# EAGLE design moonclock (EAGLE 9.6.2)
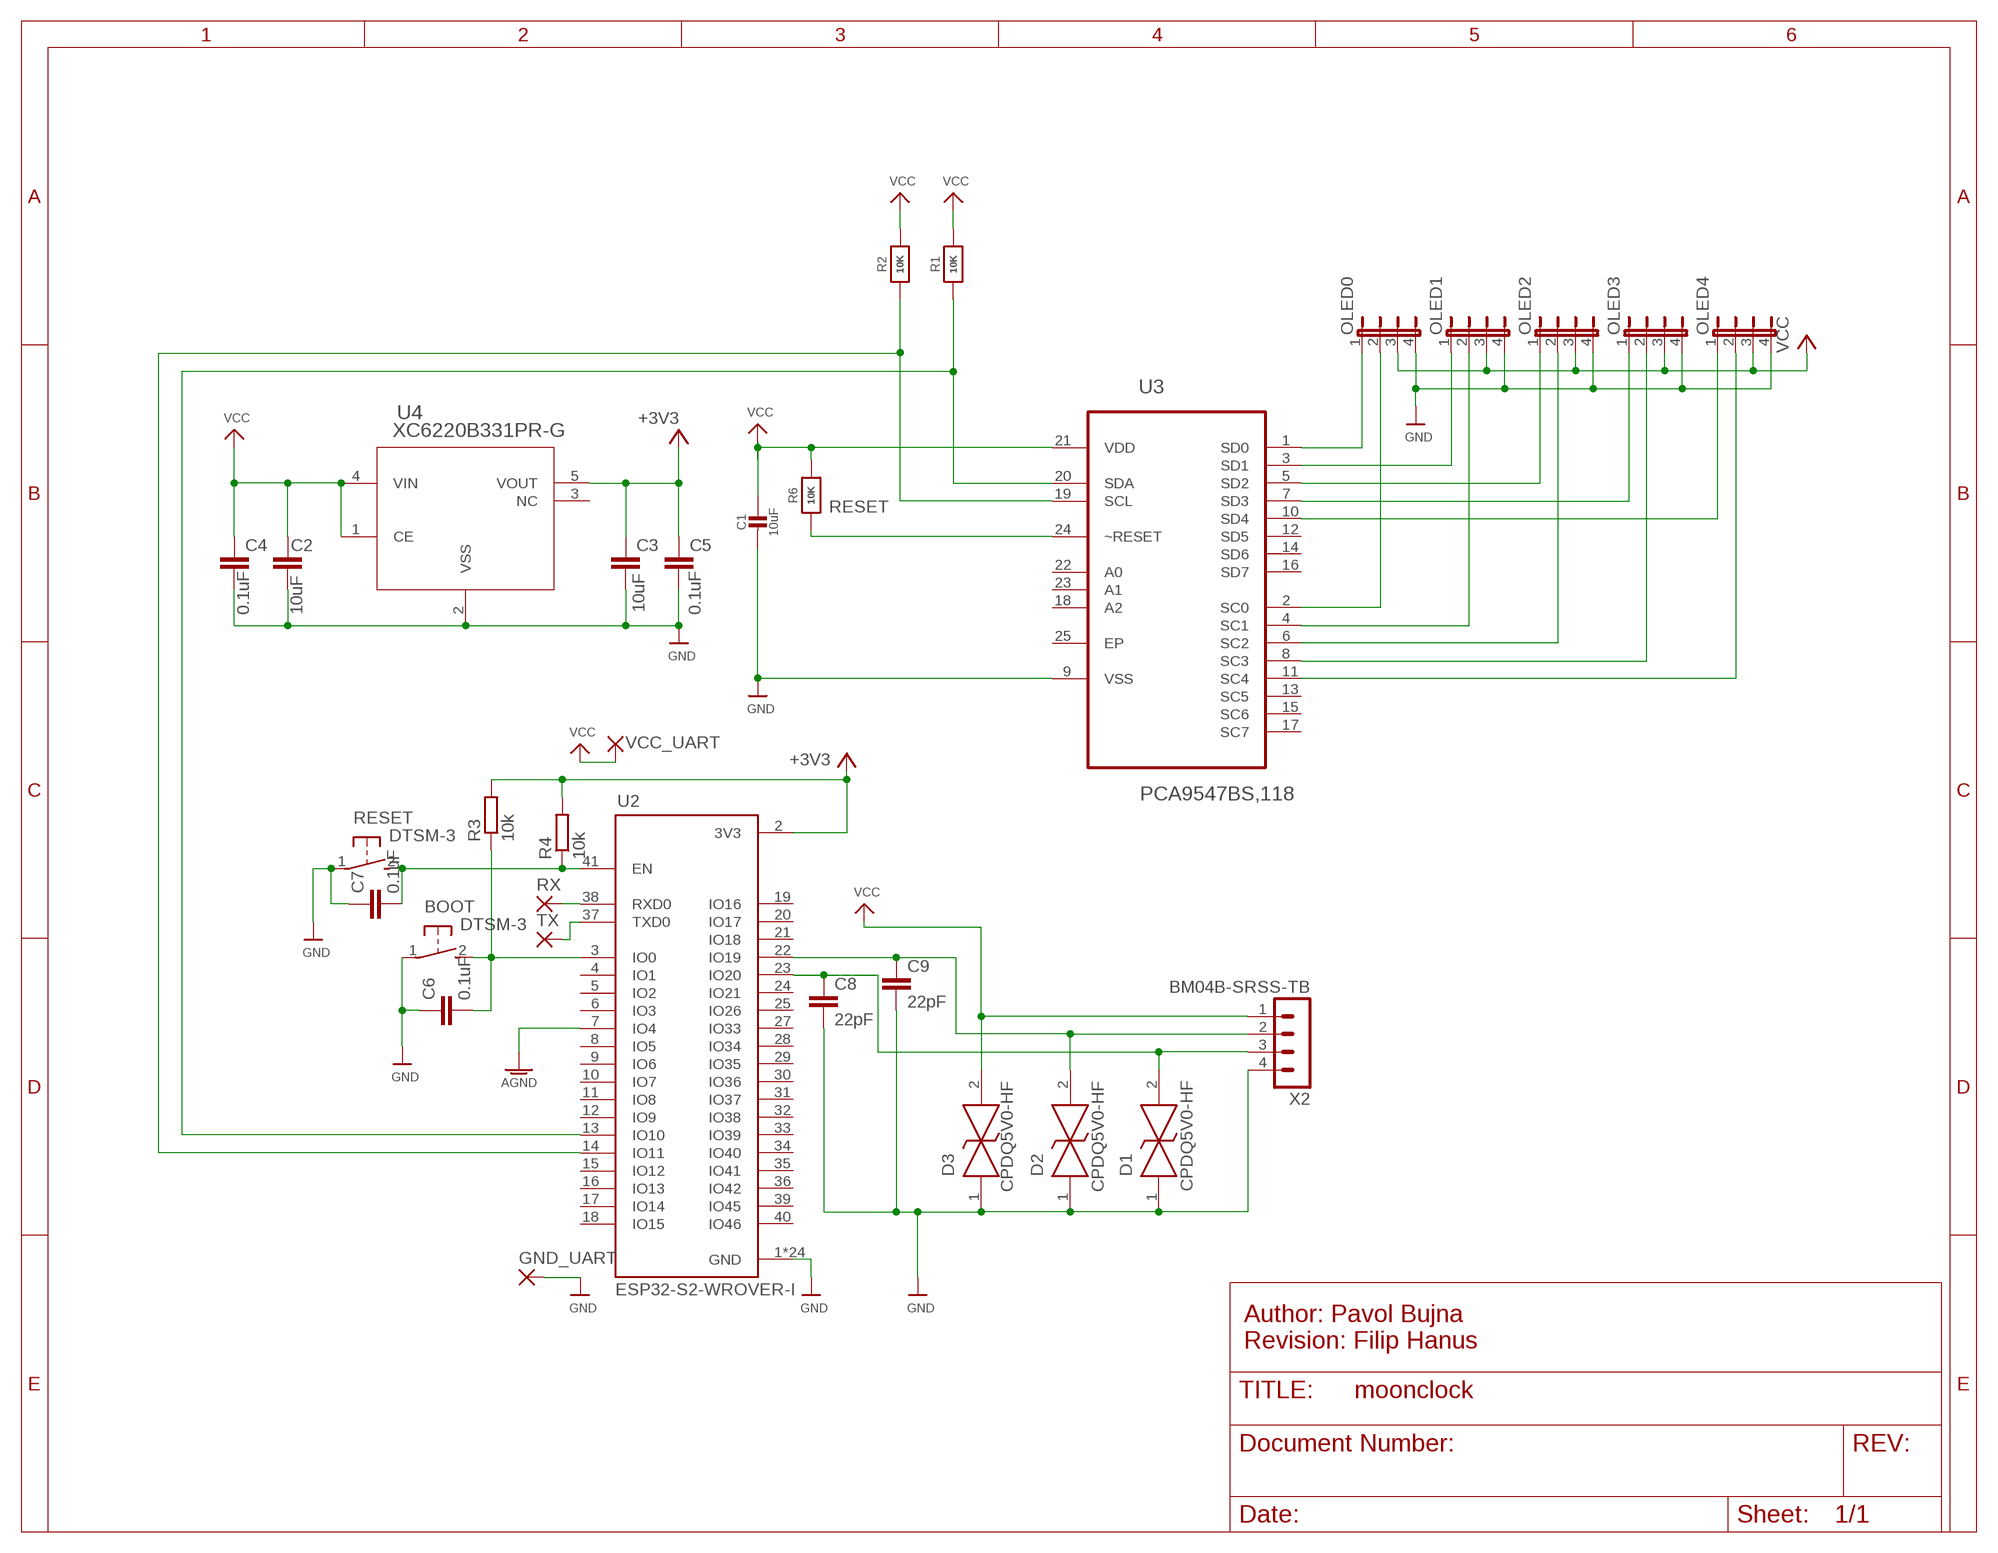
[diagram p0: schematic, sheet 1]

## Parts
BOOT  DTSM-3  [DTSM-3]
C1  10uF  CAP_CERAMIC0805-NOOUTLINE  [0805-NO]
C2  10uF  C-EUC0805  [C0805]
C3  10uF  C-EUC0805  [C0805]
C4  0.1uF  C-EUC0805  [C0805]
C5  0.1uF  C-EUC0805  [C0805]
C6  0.1uF  C-EUC0805  [C0805]
C7  0.1uF  C-EUC0805  [C0805]
C8  22pF  C-EUC0805  [C0805]
C9  22pF  C-EUC0805  [C0805]
D1  CPDQ5V0-HF  [MBTB-D-SOD-923F-IMP-0402]
D2  CPDQ5V0-HF  [MBTB-D-SOD-923F-IMP-0402]
D3  CPDQ5V0-HF  [MBTB-D-SOD-923F-IMP-0402]
GND_UART  SMD2  [SMD1,27-2,54]
OLED0  JP4E  [JP4]
OLED1  JP4E  [JP4]
OLED2  JP4E  [JP4]
OLED3  JP4E  [JP4]
OLED4  JP4E  [JP4]
R1  10K  RESISTOR0805_NOOUTLINE  [0805-NO]
R2  10K  RESISTOR0805_NOOUTLINE  [0805-NO]
R3  10k  R-EU_R0805  [R0805]
R4  10k  R-EU_R0805  [R0805]
R6  10K  RESISTOR_0805MP  [_0805MP]
RESET  DTSM-3  [DTSM-3]
RX  SMD2  [SMD1,27-2,54]
TX  SMD2  [SMD1,27-2,54]
U2  ESP32-S2-WROVER-I  [ESP32-S2-WROVER-I]
U3  PCA9547BS,118  [QFN50P400X400X100-25N]
U4  XC6220B331PR-G  [SOT-89-5_TOR]
VCC_UART  SMD2  [SMD1,27-2,54]
X2  BM04B-SRSS-TB  [BM04B-SRSS-TB]

## Nets
+3V3: C3.1 C5.1 R3.2 R4.2 U4.5(VOUT)
AGND: U2.7(IO4)
D+: C8.1 D1.2(A) U2.23(IO20) X2.3
D-: C9.1 D2.2(A) U2.22(IO19) X2.2
GND: BOOT.1 C1.2 C2.2 C3.2 C4.2 C5.2 C6.1 C7.1 C8.2 C9.2 D1.1(K) D2.1(K) D3.1(K) GND_UART.1(P) OLED0.4 OLED1.4 OLED2.4 OLED3.4 OLED4.4 RESET.1 U2.1(GND) U2.26(GND) U2.42(GND) U2.43.1(GND) U2.43.2(GND) U2.43.3(GND) U2.43.4(GND) U2.43.5(GND) U2.43.6(GND) U2.43.7(GND) U2.43.8(GND) U2.43.9(GND) U2.43.10(GND) U2.43.11(GND) U2.43.12(GND) U2.43.13(GND) U2.43.14(GND) U2.43.15(GND) U2.43.16(GND) U2.43.17(GND) U2.43.18(GND) U2.43.19(GND) U2.43.20(GND) U2.43.21(GND) U3.9(VSS) U4.2(VSS) X2.4
N$1: U2.2(3V3)
N$2: R1.1 U2.13(IO10) U3.20(SDA)
N$3: R2.1 U2.14(IO11) U3.19(SCL)
N$4: OLED0.1 U3.1(SD0)
N$5: TX.1(P) U2.37(TXD0)
N$6: RX.1(P) U2.38(RXD0)
N$7: OLED1.1 U3.3(SD1)
N$8: BOOT.2 C6.2 R3.1 U2.3(IO0)
N$9: OLED2.1 U3.5(SD2)
N$10: C7.2 R4.1 RESET.2 U2.41(EN)
N$11: OLED3.1 U3.7(SD3)
N$12: OLED4.1 U3.10(SD4)
N$13: OLED0.2 U3.2(SC0)
N$14: OLED1.2 U3.4(SC1)
N$15: OLED2.2 U3.6(SC2)
N$16: OLED3.2 U3.8(SC3)
N$17: OLED4.2 U3.11(SC4)
RESET: R6.1 U3.24(~RESET)
VCC: C1.1 C2.1 C4.1 D3.2(A) OLED0.3 OLED1.3 OLED2.3 OLED3.3 OLED4.3 R1.2 R2.2 R6.2 U3.21(VDD) U4.1(CE) U4.4(VIN) VCC_UART.1(P) X2.1
Unconnected: U2.4(IO1) U2.5(IO2) U2.6(IO3) U2.8(IO5) U2.9(IO6) U2.10(IO7) U2.11(IO8) U2.12(IO9) U2.15(IO12) U2.16(IO13) U2.17(IO14) U2.18(IO15) U2.19(IO16) U2.20(IO17) U2.21(IO18) U2.24(IO21) U2.25(IO26) U2.27(IO33) U2.28(IO34) U2.29(IO35) U2.30(IO36) U2.31(IO37) U2.32(IO38) U2.33(IO39) U2.34(IO40) U2.35(IO41) U2.36(IO42) U2.39(IO45) U2.40(IO46) U3.12(SD5) U3.13(SC5) U3.14(SD6) U3.15(SC6) U3.16(SD7) U3.17(SC7) U3.18(A2) U3.22(A0) U3.23(A1) U3.25(EP) U4.3(NC)

## Notes on the sheet
- Author: Pavol Bujna
  Revision: Filip Hanus

## Library data of the parts
BOOT RESET = switch-tact:DTSM-3
C1 = microbuilder:CAP_CERAMIC: Ceramic Capacitors For new designs, use the packages preceded by an '_' character since they are more reliable: The following footprints should be used on most boards: _0402 - Standard footprint for regular board layouts _0603 - Standard footprint for regular board layouts _0805 - Standard footprint for regular board layouts _1206 - Standard footprint for regular board layouts For extremely tight-pitch boards where space is at a premium, the following 'micro-pitch' footprints can be used (smaller pads, no silkscreen outline, etc.): _0402MP - Micro-pitch footprint for very dense/compact boards _0603MP - Micro-pitch footprint for very dense/compact boards _0805MP - Micro-pitch footprint for very dense/compact boards _1206MP - Micro-pitch footprint for very dense/compact boards
C2-C9 = rcl:C-EU: CAPACITOR, European symbol; SPICEPREFIX: C
D1-D3 = CPDQ5V0-HF:CPDQ5V0-HF: ESD Suppressors / TVS Diodes SMD ESD Diode 5V Bi-Direction Source: Datasheet <https://componentsearchengine.com/Datasheets/1/CPDQ5V0-HF.pdf> Check availability <https://pricing.snapeda.com/parts/CPDQ5V0-HF/Comchip%20Technology/view-part?ref=eda>; AVAILABILITY: In Stock; DESCRIPTION: 18.6V Clamp 9.4A (8/20µs) Ipp Tvs Diode Surface Mount 0402/SOD-923F; MF: Comchip Technology; MP: CPDQ5V0-HF; PACKAGE: 0402 Comchip; PRICE: None; PURCHASE-URL: https://pricing.snapeda.com/search/part/CPDQ5V0-HF/?ref=eda
GND_UART RX TX VCC_UART = wirepad:SMD2: SMD PAD
OLED0 OLED1-OLED4 = jumper:JP4E: JUMPER
R1 R2 R6 = microbuilder:RESISTOR: Resistors For new designs, use the packages preceded by an '_' character since they are more reliable: The following footprints should be used on most boards: _0402 - Standard footprint for regular board layouts _0603 - Standard footprint for regular board layouts _0805 - Standard footprint for regular board layouts _1206 - Standard footprint for regular board layouts For extremely tight-pitch boards where space is at a premium, the following 'micro-pitch' footprints can be used (smaller pads, no silkscreen outline, etc.): _0402MP - Micro-pitch footprint for very dense/compact boards _0603MP - Micro-pitch footprint for very dense/compact boards _0805MP - Micro-pitch footprint for very dense/compact boards _1206MP - Micro-pitch footprint for very dense/compact boards
R3 R4 = rcl:R-EU_: RESISTOR, European symbol; SPICEPREFIX: R
U2 = ESP32-S2-WROVER-I:ESP32-S2-WROVER-I: ESP32-S2-WROVER-I Module with uFL - 4 MB flash and 2 MB PSRAM
U3 = PCA9547BS_118:PCA9547BS,118: 8-channel I2C-bus multiplexer with reset Check availability <https://pricing.snapeda.com/parts/PCA9547BS%2C118/NXP%20Semiconductors/view-part?ref=eda>; AVAILABILITY: In Stock; DESCRIPTION: I2C Multiplexer 1-Element 8-IN 24-Pin HVQFN EP T/R; MF: NXP Semiconductors; MP: PCA9547BS,118; PACKAGE: None; PRICE: None; PURCHASE-URL: https://pricing.snapeda.com/search/part/PCA9547BS,118/?ref=eda
U4 = tribonix:XC6220B331PR-G; COPYRIGHT: Copyright (C) 2022 Ultra Librarian. All rights reserved.; DIGI-KEY_PART_NUMBER_1: 893-1128-1-ND; DIGI-KEY_PART_NUMBER_2: 893-1128-2-ND; DIGI-KEY_PART_NUMBER_3: 893-1128-2-NDL; DIGI-KEY_PART_NUMBER_4: 893-1128-6-ND; MANUFACTURER_PART_NUMBER: XC6220B331PR-G; MFR_NAME: Torex Semiconductor
X2 = con-JST SH:BM04B-SRSS: JST SH series header 1.00mm pitch disconnectable crimp style connectors, vertical (side entry type), 4 pins

## Board
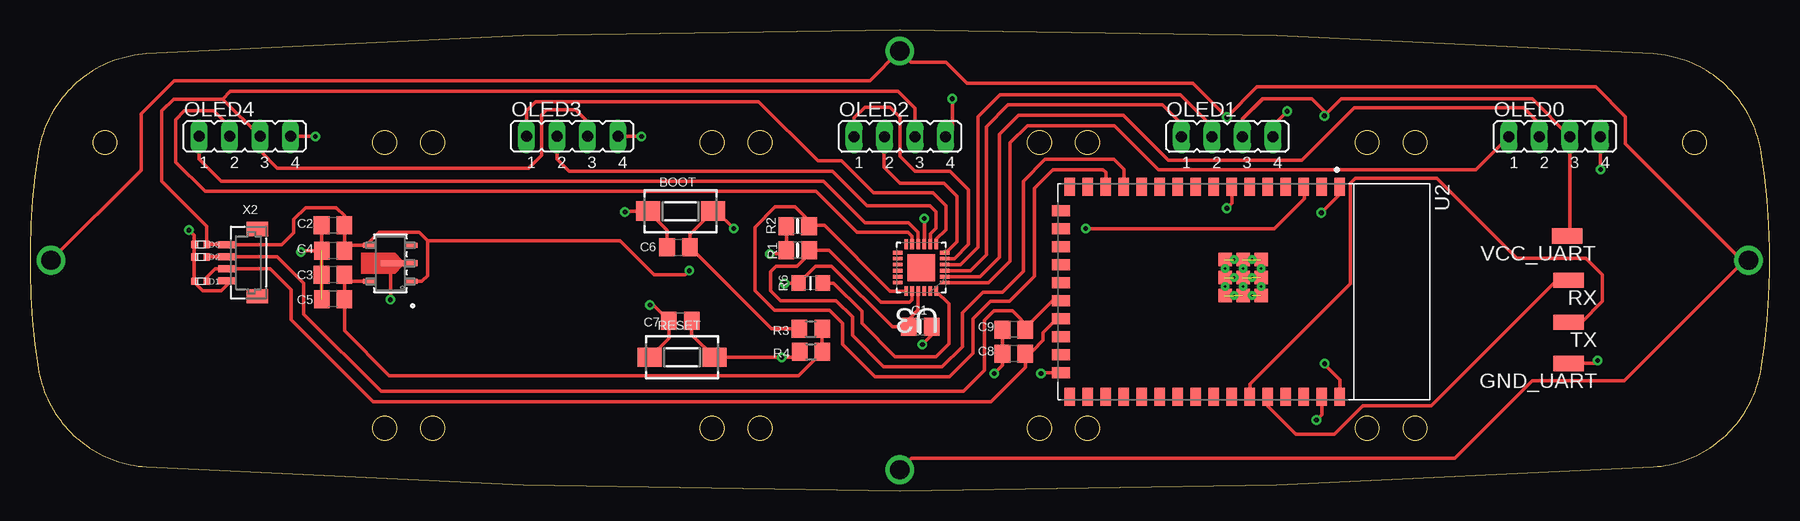
[diagram p1: board, top side]
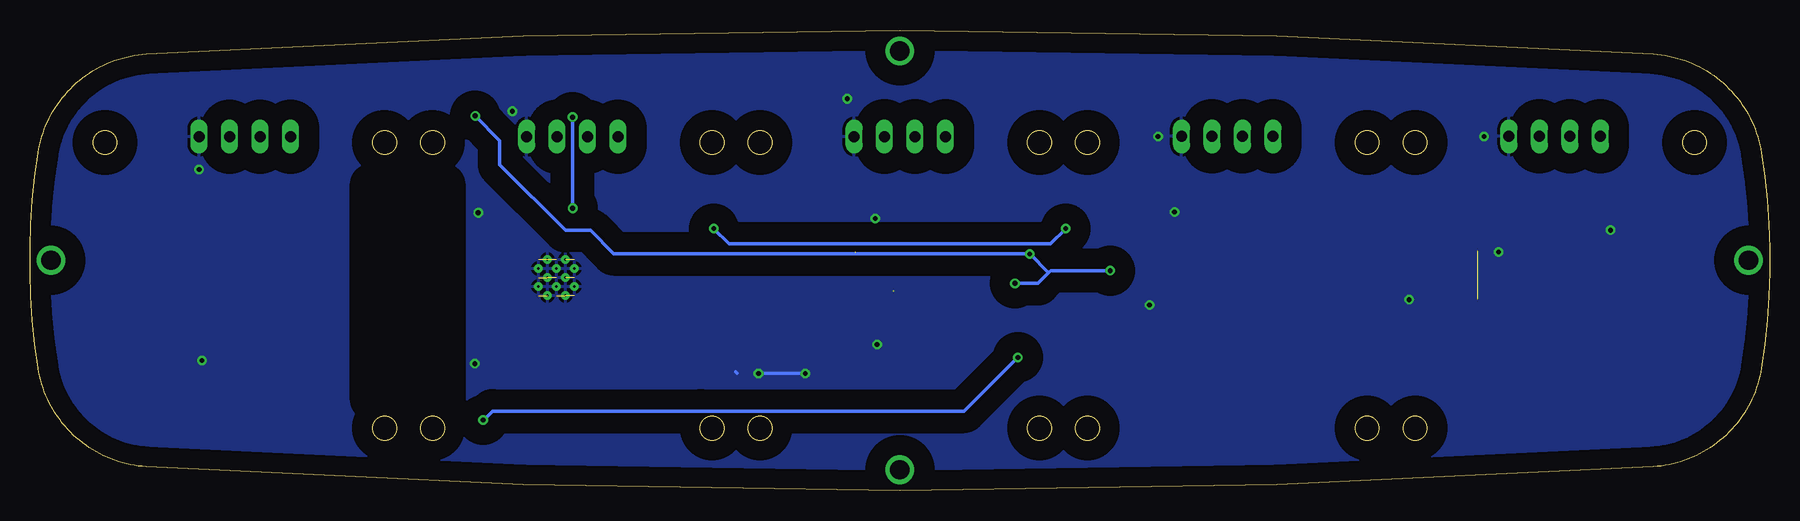
[diagram p2: board, bottom side, seen from below]

Size 145 x 38.4 mm. Coordinates in mm from the lower left corner, seen from the top.
Outline: 140.61,34.41 140.33,34.62 140.06,34.81 139.77,34.99 139.48,35.16 139.18,35.32 138.88,35.47 138.57,35.61 138.26,35.74 137.94,35.86 137.62,35.97 137.3,36.06 136.97,36.15 136.64,36.22 136.31,36.28 135.97,36.34 135.64,36.37 135.3,36.4 103.92,37.9 72.5,38.4 41.08,37.9 9.7,36.4 9.36,36.37 9.03,36.34 8.69,36.28 8.36,36.22 8.03,36.15 7.7,36.06 7.38,35.97 7.06,35.86 6.74,35.74 6.43,35.61 6.12,35.47 5.82,35.32 5.52,35.16 5.23,34.99 4.95,34.81 4.67,34.62 4.4,34.41 4.13,34.2 3.87,33.99 3.62,33.76 3.38,33.52 3.15,33.28 2.92,33.02 2.71,32.76 2.5,32.5 2.3,32.22 2.12,31.94 1.94,31.65 1.77,31.36 1.61,31.06 1.47,30.75 1.33,30.45 1.2,30.13 1.09,29.81 0.99,29.49 0.89,29.17 0.81,28.84 0.74,28.51 0.69,28.17 0.41,26.19 0.21,24.2 0.07,22.2 0,20.2 0,18.2 0.07,16.2 0.21,14.2 0.41,12.21 0.69,10.23 0.74,9.89 0.81,9.56 0.89,9.23 0.99,8.91 1.09,8.59 1.2,8.27 1.33,7.95 1.47,7.64 1.61,7.34 1.77,7.04 1.94,6.75 2.12,6.46 2.3,6.18 2.5,5.9 2.71,5.64 2.92,5.38 3.15,5.12 3.38,4.88 3.62,4.64 3.87,4.41 4.13,4.19 4.4,3.98 4.67,3.78 4.95,3.59 5.23,3.41 5.52,3.24 5.82,3.08 6.12,2.93 6.43,2.79 6.74,2.66 7.06,2.54 7.38,2.43 7.7,2.34 8.03,2.25 8.36,2.18 8.69,2.11 9.03,2.06 9.36,2.02 9.7,2 41.08,0.5 72.5,0 103.92,0.5 135.3,2 135.64,2.02 135.97,2.06 136.31,2.11 136.64,2.18 136.97,2.25 137.3,2.34 137.62,2.43 137.94,2.54 138.26,2.66 138.57,2.79 138.88,2.93 139.18,3.08 139.48,3.24 139.77,3.41 140.06,3.59 140.33,3.78 140.61,3.98 140.87,4.19 141.13,4.41 141.38,4.64 141.62,4.88 141.85,5.12 142.08,5.38 142.29,5.64 142.5,5.9 142.7,6.18 142.89,6.46 143.06,6.75 143.23,7.04 143.39,7.34 143.53,7.64 143.67,7.95 143.8,8.27 143.91,8.59 144.01,8.91 144.11,9.23 144.19,9.56 144.26,9.89 144.31,10.23 144.59,12.21 144.8,14.2 144.93,16.2 145,18.2 145,20.2 144.93,22.2 144.8,24.2 144.59,26.19 144.31,28.17 144.26,28.51 144.19,28.84 144.11,29.17 144.01,29.49 143.91,29.81 143.8,30.13 143.67,30.45 143.53,30.75 143.39,31.06 143.23,31.36 143.06,31.65 142.89,31.94 142.7,32.22 142.5,32.5 142.29,32.76 142.08,33.02 141.85,33.28 141.62,33.52 141.38,33.76 141.13,33.99 140.87,34.2 140.61,34.41
Outline: circle at 56.85,5.22 radius 1
Outline: circle at 6.25,29.02 radius 1
Outline: circle at 29.55,29.02 radius 1
Outline: circle at 115.45,29.02 radius 1
Outline: circle at 60.85,29.02 radius 1
Outline: circle at 111.45,29.02 radius 1
Outline: circle at 88.15,29.02 radius 1
Outline: circle at 84.15,29.02 radius 1
Outline: circle at 138.75,29.02 radius 1
Outline: circle at 60.85,5.22 radius 1
Outline: circle at 56.85,29.02 radius 1
Outline: circle at 84.15,5.22 radius 1
Outline: circle at 33.55,5.22 radius 1
Outline: circle at 33.55,29.02 radius 1
Outline: circle at 111.45,5.22 radius 1
Outline: circle at 88.15,5.22 radius 1
Outline: circle at 29.55,5.22 radius 1
Outline: circle at 115.45,5.22 radius 1
Copper layers (1*16): Top 0.035mm / dielectric 1.5mm / Bottom 0.035mm
Design rules "adafruit *": minimum track width 12mil, minimum drill 15.5mil, track to track 7mil, track to pad 7mil, pad to pad 7mil, via to via 7mil, smd to smd 7mil, copper to edge 10mil, drill to drill 8mil, minimum pad ring 10mil, minimum via ring 8mil, stop-mask expansion 2mil, vias tented up to drill 20mil, thermal gap 10mil

### Footprints (pad centres in the part's own frame; a part is rotated, then mirrored left to right if it is on the bottom)
DTSM-3 = smd 2 x 1.6: 1 -2.7,0; 2 2.7,0
0805-NO = smd 1.3 x 1.5: 1 -0.95,0; 2 0.95,0
C0805 = smd 1.3 x 1.5: 1 -0.95,0; 2 0.95,0
MBTB-D-SOD-923F-IMP-0402 = smd 0.5 x 0.6: 1 -0.525,0; 2 0.525,0
SMD1,27-2,54 = smd 1.27 x 2.54: 1 0,0
JP4 = drill 0.914 long: 1 -3.81,0; 2 -1.27,0; 3 1.27,0; 4 3.81,0
R0805 = smd 1.3 x 1.5: 1 -0.95,0; 2 0.95,0
_0805MP = smd 1.2 x 1.3: 1 -1.016,0; 2 1.016,0
ESP32-S2-WROVER-I = smd 1.5 x 0.9: 1 -8.75,8; 2 -8.75,6.5; 3 -8.75,5; 4 -8.75,3.5; 5 -8.75,2; 6 -8.75,0.5; 7 -8.75,-1; 8 -8.75,-2.5; 9 -8.75,-4; 10 -8.75,-5.5; 11 -8.75,-7; 12 -8.75,-8.5; 13 -8.75,-10; 14 -8.75,-11.5; 15 -8.75,-13; 16 -8.75,-14.5; 27 8.75,-14.5; 28 8.75,-13; 29 8.75,-11.5; 30 8.75,-10; 31 8.75,-8.5; 32 8.75,-7; 33 8.75,-5.5; 34 8.75,-4; 35 8.75,-2.5; 36 8.75,-1; 37 8.75,0.5; 38 8.75,2; 39 8.75,3.5; 40 8.75,5; 41 8.75,6.5; 42 8.75,8 | smd 0.9 x 1.5: 17 -6.75,-15.25; 18 -5.25,-15.25; 19 -3.75,-15.25; 20 -2.25,-15.25; 21 -0.75,-15.25; 22 0.75,-15.25; 23 2.25,-15.25; 24 3.75,-15.25; 25 5.25,-15.25; 26 6.75,-15.25 | smd 1.1 x 1.1: 43.1 -1.19,-0.05; 43.2 -2.69,-0.05; 43.3 0.31,-0.05; 43.4 -2.69,-1.55; 43.5 -1.19,-1.55; 43.6 0.31,-1.55; 43.7 -2.69,1.45; 43.8 -1.19,1.45; 43.9 0.31,1.45 | drill 0.2 pad 0.4: 43.10 -1.19,0.7; 43.11 -2.69,0.7; 43.12 0.31,0.7; 43.13 -2.69,-0.8; 43.14 -1.19,-0.8; 43.15 0.31,-0.8; 43.16 -1.94,1.45; 43.17 -0.44,1.45; 43.18 -1.94,-0.05; 43.19 -0.44,-0.05; 43.20 -1.94,-1.55; 43.21 -0.44,-1.55
QFN50P400X400X100-25N = smd 0.813 x 0.305: 1 -1.956,1.245; 2 -1.956,0.762; 3 -1.956,0.254; 4 -1.956,-0.254; 5 -1.956,-0.762; 6 -1.956,-1.245; 13 1.956,-1.245; 14 1.956,-0.762; 15 1.956,-0.254; 16 1.956,0.254; 17 1.956,0.762; 18 1.956,1.245 | smd 0.305 x 0.813: 7 -1.245,-1.956; 8 -0.762,-1.956; 9 -0.254,-1.956; 10 0.254,-1.956; 11 0.762,-1.956; 12 1.245,-1.956; 19 1.245,1.956; 20 0.762,1.956; 21 0.254,1.956; 22 -0.254,1.956; 23 -0.762,1.956; 24 -1.245,1.956 | smd 2.261 x 2.261: 25 0,0
SOT-89-5_TOR = smd 0.432 x 1.016: 1 -1.5,-1.753; 3 1.5,-1.753; 4 1.5,1.753; 5 -1.5,1.753 | smd 0.483 x 3.048: 2 0,-0.749
BM04B-SRSS-TB = smd 0.6 x 1.55: 1 1.5,0; 2 0.5,0; 3 -0.5,0; 4 -1.5,0 | smd 1.2 x 1.8: M1 2.8,-2.525; M2 -2.8,-2.525

### Placement (x,y rotation side)
BOOT  54.23,23.31 0 top
C1  74.2,13.66 0 top
C2  25.26,22.11 180 top
C3  25.26,18.01 180 top
C4  25.27,19.99 180 top
C5  25.27,15.98 180 top
C6  54.06,20.3 0 top
C7  54.2,14.18 0 top
C8  82.01,11.41 180 top
C9  82.01,13.44 180 top
D1  14.19,17.45 0 top
D2  14.19,19.49 0 top
D3  14.19,20.53 0 top
GND_UART  128.25,10.61 90 top
OLED0  127.1,29.52 0 top
OLED1  99.8,29.52 0 top
OLED2  72.5,29.52 0 top
OLED3  45.19,29.53 0 top
OLED4  17.9,29.53 0 top
R1  64,20.04 180 top
R2  63.99,22.06 180 top
R3  65.09,13.49 0 top
R4  65.11,11.6 0 top
R6  65.08,17.31 180 top
RESET  54.36,11.12 0 top
RX  128.25,17.55 90 top
TX  128.26,14.04 90 top
U2  101.17,16.58 270 top
U3  74.29,18.6 180 top
U4  30.04,18.95 90 top
VCC_UART  128.13,21.24 90 top
X2  16.45,19.01 90 top

### Tracks (layer width: path | path; a pad name or v marks a point on that pad's centre or on a via)
+3V3
  Top 0.305: 26.22,17.4 C5.1 26.22,13.33 29.94,9.6 64.06,9.6 R4.2 66.04,11.61 R3.2 | 26.22,17.4 C3.1 | U4.5 26.27,17.45 26.22,17.4
AGND  (via drill 0.39, 1.6 pad 2.4)
  Top 0.305: 100.25,25.41 U2.7 100.17,23.95 v99.76,23.55 | v1.75,19.2 9.26,26.72 9.26,31.42 12.03,34.19 70.03,34.19 v72.5,36.65 73.43,35.72 76.35,35.72 78.1,33.96 96.95,33.96 v99.77,31.14 102.28,33.65 130.5,33.65 132.97,31.19 132.97,28.93 142.7,19.2 v143.26,19.2 142.93,19.2 132.89,9.17 125.24,9.17 118.79,2.72 73.49,2.72 72.52,1.75 v72.5,1.75
  Bottom 0.305: v99.76,23.55 v99.76,31.14 v99.77,31.14
D+
  Top 0.305: D1.2 14.72,17.8 15.43,18.51 X2.3 20.01,18.51 21.76,16.77 21.76,14.25 28.59,7.42 80.11,7.42 82.96,10.27 C8.1 | C8.1 82.96,11.83 | C8.1 83.21,11.66 83.59,11.66 84.45,12.53 84.45,13.19 85.59,14.33 U2.23
D-
  Top 0.305: D2.2 16.42,19.48 X2.2 20.61,19.51 22.83,17.3 22.83,14.71 29.25,8.28 77.82,8.28 79.57,10.04 79.57,14.21 80.36,14.99 81.88,14.99 83.43,13.44 C9.1 82.96,13.58 85.21,15.83 U2.22
GND  (via drill 0.39)  (11 unrouted)
  Top 0.305: X2.4 16.45,17.17 15.94,16.67 14.38,16.67 13.67,17.38 D1.1 D2.1 D3.1 13.67,21.31 v13.25,21.72 | C2.2 C5.2 24.3,15.96 | U4.2 30.04,18.2 v30.04,15.93 | C6.1 53.11,21.73 BOOT.1 49.67,23.31 v49.6,23.24 | RESET.1 53.25,12.71 C7.1 51.96,15.47 v51.68,15.47 | C9.2 C8.2 81.06,10.46 v80.38,9.78 | U3.9 v74.54,22.69 | OLED0.4 v130.91,26.78 v130.91,26.77 | GND_UART.1 130.44,10.61 v130.68,10.85 | U2.42 109.17,9.24 107.92,10.5 v107.92,10.59 | U2.1 109.17,24.7 v107.64,23.17 | OLED2.4 76.88,30.09 v76.88,32.67 | C1.2 75.15,12.96 v74.39,12.19 | U2.26 84.32,9.83 v84.27,9.78 | OLED3.4 50.96,29.53 v50.97,29.52 | OLED4.4 23.78,29.53 v23.79,29.52 | C4.2 22.68,19.99 v22.57,19.89 | OLED1.4 103.61,30.44 v104.79,31.63
  Bottom 0.305: v80.38,9.78 v84.27,9.78 | 86.05,9.78 86.18,9.91
  pour Bottom (isolate 1.676): 0.43,27.79 0.43,31.85 5.25,36.68 8.55,39.98 134.03,39.98 139.87,39.98 146.73,33.12 147.75,32.11 147.75,10.01 135.3,-2.44 122.35,-2.44 5,-2.44 2.46,0.1 -2.62,5.18 -2.62,25.5 -0.34,27.79
N$2
  Top 0.305: 73.53,15.9 73.32,15.7 70.94,15.7 66.59,20.04 R1.1 64.95,19.71 63.96,18.72 62.18,18.72 61.72,18.26 61.72,16.69 62.55,15.85 67.2,15.85 68.55,14.51 68.55,12.96 71.16,10.34 76.04,10.34 77.72,12.02 77.72,14.84 79.42,16.54 81.05,16.54 82.82,18.32 82.82,25.81 84.62,27.61 90.37,27.61 91.17,26.81 U2.13 | 73.53,15.9 73.53,15.99 | 73.53,15.99 73.54,16 73.54,15.92 73.53,15.9 | U3.20 73.53,15.99
N$3  (1 unrouted)
  Top 0.305: 72.97,16.64 71.7,16.64 66.21,22.13 65,22.13 R2.1 65.04,22.17 65.27,22.17 63.79,23.65 62.12,23.65 60.42,21.95 60.42,16.69 62.07,15.04 66.64,15.04 67.74,13.95 67.74,12.22 70.45,9.5 76.65,9.5 78.61,11.46 78.61,14.33 80.08,15.8 81.65,15.8 83.71,17.86 83.71,25.2 85.26,26.75 89.45,26.75 89.67,26.53 U2.14
N$4
  Top 0.305: OLED0.1 120.52,26.75 94.08,26.75 90.39,30.43 83.13,30.43 81.69,29 81.69,19.14 79.9,17.35 U3.1
N$5
  Top 0.305: U2.37 101.67,8.86 110.06,17.26 110.06,25.64 110.46,26.04 117.27,26.04 123.92,19.38 129.69,19.38 131.08,17.99 131.08,15.78 129.35,14.04 TX.1
N$6
  Top 0.305: U2.38 103.18,7.82 103.18,7.04 105.51,4.71 108.73,4.71 111.12,7.09 116.81,7.09 127.27,17.55 RX.1
N$7
  Top 0.305: U3.3 78.41,18.34 79.73,19.66 79.73,30.36 81.53,32.16 94.41,32.16 95.99,30.59 OLED1.1
N$8  (via drill 0.39)
  Top 0.305: R3.1 61.82,13.49 C6.2 55.01,21.39 BOOT.2 57.21,23.31 v58.67,21.85 | U2.3 106.24,25.26 106.24,24.34 103.75,21.85 v88,21.85
  Bottom 0.305: v88,21.85 86.73,20.58 59.94,20.58 v58.67,21.85
N$9
  Top 0.305: OLED2.1 68.69,31.09 69.59,31.98 71.67,31.98 72.51,31.14 72.51,27.87 73.76,26.62 76.68,26.62 78.23,25.07 78.23,20.53 77.06,19.36 U3.5
N$10  (via drill 0.39)
  Top 0.305: C7.2 55.15,13.02 RESET.2 v62.66,11.12 63.68,11.12 R4.1 | U2.41 107.67,6.33 v107.23,5.9
  Bottom 0.305: v107.23,5.9 107.21,5.87 106.45,6.63 89.1,6.63 67.14,6.63 v62.66,11.12
N$11
  Top 0.305: OLED3.1 41.38,31.66 42.16,32.44 60.73,32.44 65.68,27.49 67.66,27.49 70.33,24.82 75.28,24.82 76.35,23.75 76.35,21.77 75.53,20.96 U3.7
N$12
  Top 0.305: OLED4.1 14.09,27.61 15.92,25.78 66.14,25.78 69.59,22.33 73.25,22.33 74.03,21.54 U3.10
N$13
  Top 0.305: U3.2 79.19,17.83 80.8,19.45 80.8,29.71 82.39,31.3 91.15,31.3 94.91,27.53 106.01,27.53 110.38,31.91 124.5,31.91 125.83,30.58 OLED0.2
N$14
  Top 0.305: OLED1.2 98.53,30.38 95.88,33.02 80.87,33.02 79.01,31.17 79.01,20.3 77.57,18.85 U3.4
N$15  (1 unrouted)
  Top 0.305: 76.24,19.92 76.42,19.92 77.26,20.75 77.26,24.56 76.19,25.63 72.51,25.63 71.19,26.95 71.19,29.48 OLED2.2
N$16
  Top 0.305: OLED3.2 43.92,27.63 44.93,26.62 66.9,26.62 69.77,23.75 75.03,23.75 75.51,23.27 75.51,21.9 75.05,21.44 U3.8
N$17
  Top 0.305: OLED4.2 16.63,30.34 15.33,31.65 12.87,31.65 12.16,30.94 12.16,27.38 14.6,24.95 65.53,24.95 68.93,21.54 73.2,21.54 73.53,21.21 U3.11
RESET
  Top 0.305: U3.24 76.6,15.57 76.6,12.27 75.51,11.18 72.1,11.18 69.34,13.95 69.34,14.96 66.99,17.31 R6.1
VCC  (via drill 0.39)
  Top 0.305: C4.1 26.22,20.45 | 26.22,20.45 C2.1 | C2.1 | 26.22,20.45 U4.4 28.29,20.73 29.1,21.54 32.45,21.54 33.14,20.86 | U4.1 32.66,17.45 33.14,17.94 33.14,20.86 | 64.11,17.36 R6.2 | 64.11,17.35 R6.2 | U3.21 74.03,15.09 73.25,14.31 C1.1 71.88,13.66 66.82,18.72 65.48,18.72 R6.2 | C2.1 26.22,22.9 25.52,23.6 22.98,23.6 21.99,22.61 21.99,21.52 20.99,20.51 X2.1 16.43,20.53 D3.2 14.73,22.05 10.99,25.78 10.99,31.65 11.98,32.64 16.06,32.64 | 16.06,32.64 OLED4.3 19.17,28.32 20.62,26.88 41.57,26.88 42.67,27.97 42.67,31.35 43.07,31.75 45.46,31.75 46.46,30.75 OLED3.3 | 16.06,32.64 16.7,33.28 72.36,33.28 73.77,31.86 OLED2.3 | VCC_UART.1 128.37,21.48 OLED0.3 125.22,32.67 109.32,32.67 v107.89,31.25 107.94,31.3 107.94,31.58 106.85,32.67 102.79,32.67 101.07,30.94 OLED1.3 101.07,30.99 102.74,32.67 | R2.2 63.05,22.06 R1.2 62.74,19.74 v61.66,19.74 | 33.14,20.86 49.17,20.86 52.04,17.99 54.6,17.99 v54.96,18.34 | R6.2 62.92,17.31 v62.9,17.29
  Bottom 0.305: v54.96,18.34 59.91,18.34 60.09,18.16 | 60.09,18.16 v61.66,19.74 61.69,19.76 96.36,19.76 98.29,21.69 100.37,21.69 105.84,27.16 105.84,29.19 v107.89,31.25 | v62.9,17.29 60.97,17.29 60.09,18.16